# Altium schematic sheet CF_ALIM.SchDoc: CF_ALIM
size Tabloid; DocumentNumber: 3; SheetNumber: 3; SheetTotal: 10; SheetName: test; Sheet_Name: CF_ALIM; Size: 11x17; DocumentName: CF_ALIM
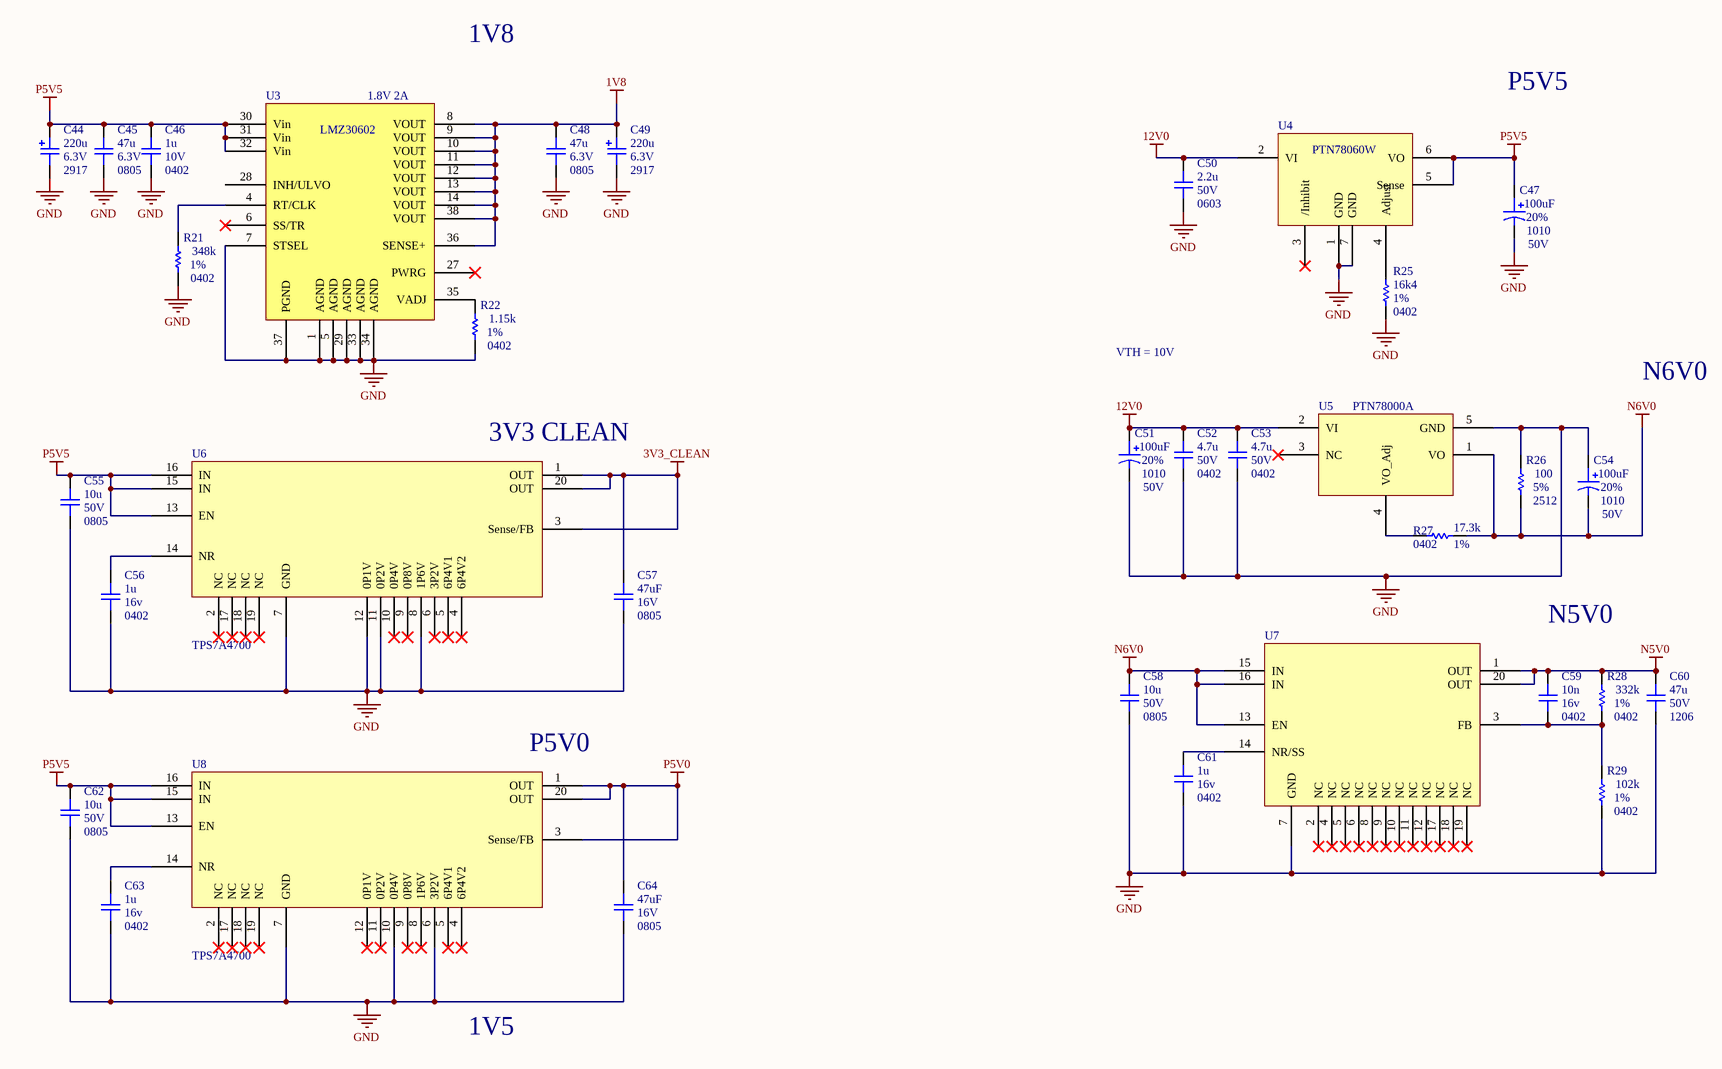
[diagram p0: CF_ALIM.SchDoc]

## Parts
C44  value 220u  Voltage: 6.3V  Package: 2917  [CAP_TAN_2917(D)]  (hidden comment: CAP - TANTALUM - CASE D)
C45  value 47u  Voltage: 6.3V  Package: 0805  [CAP_0805]  (hidden comment: CAP - 0805)
C46  value 1u  Voltage: 10V  Package: 0402  [CAP_0402]  (hidden comment: CAP - 0402)
C47  value 100uF  Voltage: 50V  Package: 1010  Precision: 20%  [CapacitorE]  (hidden comment: MAL215099101E3)
C48  value 47u  Voltage: 6.3V  Package: 0805  [CAP_0805]  (hidden comment: CAP - 0805)
C49  value 220u  Voltage: 6.3V  Package: 2917  [CAP_TAN_2917(D)]  (hidden comment: CAP - TANTALUM - CASE D)
C50  value 2.2u  Voltage: 50V  Package: 0603  [CAP_0603]  (hidden comment: CAP - 0603)
C51  value 100uF  Voltage: 50V  Package: 1010  Precision: 20%  [CapacitorE]  (hidden comment: MAL215099101E3)
C52  value 4.7u  Voltage: 50V  Package: 0402  [CAP_0402]  (hidden comment: CAP - 0402)
C53  value 4.7u  Voltage: 50V  Package: 0402  [CAP_0402]  (hidden comment: CAP - 0402)
C54  value 100uF  Voltage: 50V  Package: 1010  Precision: 20%  [CapacitorE]  (hidden comment: MAL215099101E3)
C55  value 10u  Voltage: 50V  Package: 0805  [CAP_0402]  (hidden comment: CAP - 0402)
C56  value 1u  Voltage: 16v  Package: 0402  [CAP_0402]  (hidden comment: CAP - 0402)
C57  value 47uF  Voltage: 16V  Package: 0805  [CAP_0805]  (hidden comment: CAP - 0805)
C58  value 10u  Voltage: 50V  Package: 0805  [CAP_0402]  (hidden comment: CAP - 0402)
C59  value 10n  Voltage: 16v  Package: 0402  [CAP_0402]  (hidden comment: CAP - 0402)
C60  value 47u  Voltage: 50V  Package: 1206  [CAP_1206]  (hidden comment: CAP - 1206)
C61  value 1u  Voltage: 16v  Package: 0402  [CAP_0402]  (hidden comment: CAP - 0402)
C62  value 10u  Voltage: 50V  Package: 0805  [CAP_0402]  (hidden comment: CAP - 0402)
C63  value 1u  Voltage: 16v  Package: 0402  [CAP_0402]  (hidden comment: CAP - 0402)
C64  value 47uF  Voltage: 16V  Package: 0805  [CAP_0805]  (hidden comment: CAP - 0805)
R21  value 348k  Package: 0402  Precision: 1%  [RES_0402]  (hidden comment: RES - 0402)
R22  value 1.15k  Package: 0402  Precision: 1%  [RES_0402]  (hidden comment: RES - 0402)
R25  value 16k4  Package: 0402  Precision: 1%  [RES_0402]  (hidden comment: RES - 0402)
R26  value 100  Package: 2512  Precision: 5%  [C2512]  (hidden comment: RES - 0402)
R27  value 17.3k  Package: 0402  Precision: 1%  [RES_0402]  (hidden comment: RES - 0402)
R28  value 332k  Package: 0402  Precision: 1%  [RES_0402]  (hidden comment: RES - 0402)
R29  value 102k  Package: 0402  Precision: 1%  [RES_0402]  (hidden comment: RES - 0402)
U3  LMZ30602  [RKG39 QFN]
U4  PTN78060W  [EUW]
U5  PTN78000A  [PTN78000A]
U6  TPS7A4700  [TPS7A4700]
U7  (no value)  [TPS7A4700]
U8  TPS7A4700  [TPS7A4700]

## Nets
1V8: C48.2 C49.2 U3.8(VOUT) U3.9(VOUT) U3.10(VOUT) U3.11(VOUT) U3.12(VOUT) U3.13(VOUT) U3.14(VOUT) U3.36(SENSE+) U3.38(VOUT)
3V3_CLEAN: C57.2 U6.1(OUT) U6.3(Sense/FB) U6.20(OUT)
12V0: C50.2 C51.1 C52.2 C53.2 U4.2(VI) U5.2(VI)
GND: C44.1 C45.1 C46.1 C47.2 C48.1 C49.1 C50.1 C51.2 C52.1 C53.1 C54.1 C55.1 C56.1 C57.1 C58.1 C60.1 C61.1 C62.1 C63.1 C64.1 R21.1 R22.1 R25.1 R26.2 R29.1 U3.1(AGND) U3.5(AGND) U3.7(STSEL) U3.29(AGND) U3.33(AGND) U3.34(AGND) U3.37(PGND) U4.1(GND) U4.7(GND) U5.5(GND) U6.7(GND) U6.8(1P6V) U6.11(0P2V) U6.12(0P1V) U7.7(GND) U8.6(3P2V) U8.7(GND) U8.10(0P4V)
N5V0: C59.2 C60.2 R28.2 U7.1(OUT) U7.20(OUT)
N6V0: C54.2 C58.2 R26.1 R27.1 U5.1(VO) U7.13(EN) U7.15(IN) U7.16(IN)
P5V0: C64.2 U8.1(OUT) U8.3(Sense/FB) U8.20(OUT)
P5V5: C44.2 C45.2 C46.2 C47.1 C55.2 C62.2 U3.30(Vin) U3.31(Vin) U3.32(Vin) U4.5(Sense) U4.6(VO) U6.13(EN) U6.15(IN) U6.16(IN) U8.13(EN) U8.15(IN) U8.16(IN)
NetC56_2: C56.2 U6.14(NR)
NetC59_1: C59.1 R28.1 R29.2 U7.3(FB)
NetC61_2: C61.2 U7.14(NR/SS)
NetC63_2: C63.2 U8.14(NR)
NetR21_2: R21.2 U3.4(RT/CLK)
NetR22_2: R22.2 U3.35(VADJ)
NetR25_2: R25.2 U4.4(Adjust)
NetR27_2: R27.2 U5.4(VO_Adj)

Not connected (* = marked no-connect by the designer): U3 6(SS/TR)* 27(PWRG)* 28(INH/ULVO); U4 3(/Inhibit)*; U5 3(NC)*; U6 2(NC)* 4(6P4V2)* 5(6P4V1)* 6(3P2V)* 9(0P8V)* 10(0P4V)* 17(NC)* 18(NC)* 19(NC)*; U7 2(NC)* 4(NC)* 5(NC)* 6(NC)* 8(NC)* 9(NC)* 10(NC)* 11(NC)* 12(NC)* 17(NC)* 18(NC)* 19(NC)*; U8 2(NC)* 4(6P4V2)* 5(6P4V1)* 8(1P6V)* 9(0P8V)* 11(0P2V)* 12(0P1V)* 17(NC)* 18(NC)* 19(NC)*

## Notes on the sheet
- (near U3) 1.8V 2A
- 1V8
- P5V5
- VTH = 10V
- N6V0
- (near U6) 3V3 CLEAN
- N5V0
- (near U8) P5V0
- 1V5
- Sheet Name
- Project Title
- Global Project
- Size
- Group
- Revision
- Date
- Sheet
- of
- Filename
- Designers

## Library data of the parts
C44 C49 = CAP_TANT_2917(D): CAP - TANTALUM - 2917; pin to pad: 1>2 2>1; Precision: 10%; Current: *; CreatedBy: Jonathan Bouchard; Power: *
C45 C48 C57 C64 = CAP - 0805: Precision: 10%; Current: *; CreatedBy: Jonathan Bouchard; Power: *
C46 C52 C53 C55 C56 C58 C59 C61-C63 = CAP - 0402: Precision: 10%; Current: *; CreatedBy: Jonathan Bouchard; Power: *
C47 C51 C54 = CAP_ALU_MAL215099101E3: CAP - ALU 100uF 20% 50V - 1010; pin to pad: 1>2 2>1; Current: 490mA; Mfg: Vishay Dale; Mfg Part Number: MAL215099101E3; HelpURL: http://www.vishay.com/docs/28395/150crz.pdf; CreatedBy: Jonathan Bouchard; Temperature: -55°C to 125°C; Power: *; Supplier 1: Digikey; Supplier Part Number 1: 4399PHDKR-ND
C50 = CAP - 0603: Precision: 10%; Current: *; CreatedBy: Jonathan Bouchard; Power: *
C60 = CAP - 1206: Precision: 10%; Current: *; CreatedBy: Jonathan Bouchard; Power: *
R21 R22 R25-R29 = RES - 0402: Voltage: 50V; Power: 1/16W; Current: *; CreatedBy: Jonathan Bouchard
U3 = LMZ3602: 2A Power Module
U4 = PTN78060W: Wide input volate regulator; Output Current: 3A
U7 = TPS7A33